# EAGLE design version1 (EAGLE 6.6.0)
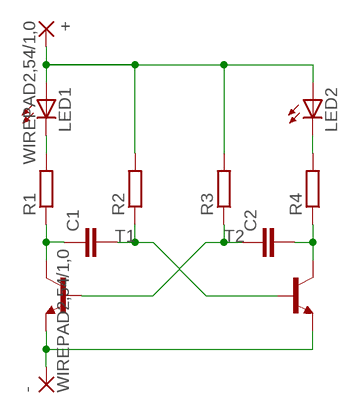
[diagram p0: schematic, sheet 1]

## Parts
+  WIREPAD2,54/1,0  [2,54/1,0]
-  WIREPAD2,54/1,0  [2,54/1,0]
C1  C-EUC0603  [C0603]
C2  C-EUC0603  [C0603]
LED1  LEDSML0603  [SML0603]
LED2  LEDSML0603  [SML0603]
R1  R-EU_R0603  [R0603]
R2  R-EU_R0603  [R0603]
R3  R-EU_R0603  [R0603]
R4  R-EU_R0603  [R0603]
T1  MMBT2222ALT1-NPN-SOT23-BEC  [SOT23-BEC]
T2  MMBT2222ALT1-NPN-SOT23-BEC  [SOT23-BEC]

## Nets
N$1: LED1.C R1.2
N$2: C1.1 R1.1 T1.C
N$3: C2.2 R4.1 T2.C
N$4: LED2.C R4.2
N$5: C1.2 R2.1 T2.B
N$6: C2.1 R3.1 T1.B
N$7: +.1(P) LED1.A LED2.A R2.2 R3.2
N$9: -.1(P) T1.E T2.E

## Library data of the parts
+ - = wirepad:WIREPAD: Wire PAD connect wire on PCB
C1 C2 = rcl:C-EU: CAPACITOR, European symbol
LED1 LED2 = led:LED: LED OSRAM: - CHIPLED LG R971, LG N971, LY N971, LG Q971, LY Q971, LO R971, LY R971 LH N974, LH R974 LS Q976, LO Q976, LY Q976 LO Q996 - Hyper CHIPLED LW Q18S LB Q993, LB Q99A, LB R99A - SideLED LS A670, LO A670, LY A670, LG A670, LP A670 LB A673, LV A673, LT A673, LW A673 LH A674 LY A675 LS A676, LA A676, LO A676, LY A676, LW A676 LS A679, LY A679, LG A679 - Hyper Micro SIDELED® LS Y876, LA Y876, LO Y876, LY Y876 LT Y87S - SmartLED LW L88C, LW L88S LB L89C, LB L89S, LG L890 LS L89K, LO L89K, LY L89K LS L896, LA L896, LO L896, LY L896 - TOPLED LS T670, LO T670, LY T670, LG T670, LP T670 LSG T670, LSP T670, LSY T670, LOP T670, LYG T670 LG T671, LOG T671, LSG T671 LB T673, LV T673, LT T673, LW T673 LH T674 LS T676, LA T676, LO T676, LY T676, LB T676, LH T676, LSB T676, LW T676 LB T67C, LV T67C, LT T67C, LS T67K, LO T67K, LY T67K, LW E67C LS E67B, LA E67B, LO E67B, LY E67B, LB E67C, LV E67C, LT E67C LW T67C LS T679, LY T679, LG T679 LS T770, LO T770, LY T770, LG T770, LP T770 LB T773, LV T773, LT T773, LW T773 LH T774 LS E675, LA E675, LY E675, LS T675 LS T776, LA T776, LO T776, LY T776, LB T776 LHGB T686 LT T68C, LB T68C - Hyper Mini TOPLED® LB M676 - Mini TOPLED Santana® LG M470 LS M47K, LO M47K, LY M47K Source: http://www.osram.convergy.de LUXEON: - LUMILED® LXK2-PW12-R00, LXK2-PW12-S00, LXK2-PW14-U00, LXK2-PW14-V00 LXK2-PM12-R00, LXK2-PM12-S00, LXK2-PM14-U00 LXK2-PE12-Q00, LXK2-PE12-R00, LXK2-PE12-S00, LXK2-PE14-T00, LXK2-PE14-U00 LXK2-PB12-K00, LXK2-PB12-L00, LXK2-PB12-M00, LXK2-PB14-N00, LXK2-PB14-P00, LXK2-PB14-Q00 LXK2-PR12-L00, LXK2-PR12-M00, LXK2-PR14-Q00, LXK2-PR14-R00 LXK2-PD12-Q00, LXK2-PD12-R00, LXK2-PD12-S00 LXK2-PH12-R00, LXK2-PH12-S00 LXK2-PL12-P00, LXK2-PL12-Q00, LXK2-PL12-R00 Source: www.luxeon.com KINGBRIGHT: KA-3528ASYC Source: www.kingbright.com
R1-R4 = rcl:R-EU_: RESISTOR, European symbol
T1 T2 = transistor-neu-to92:*-NPN-: NPN Transistror

## Board
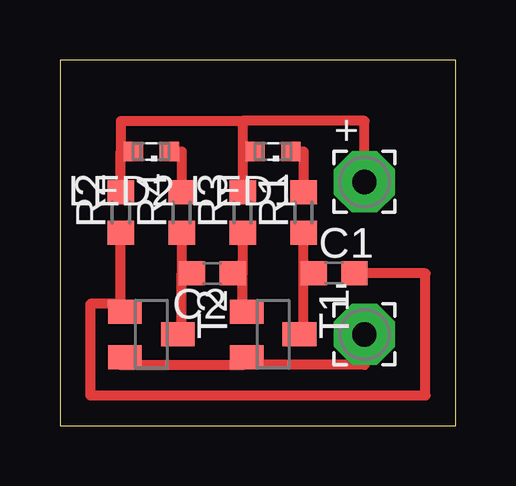
[diagram p1: board, top side]

Size 16.51 x 15.24 mm. Coordinates in mm from the lower left corner, seen from the top.
Outline: 0,0 16.51,0 16.51,15.24 0,15.24 0,0
Copper layers (1*16): Top 0.035mm / dielectric 1.5mm / Bottom 0.035mm
Design rules "default": minimum track width 10mil, minimum drill 24mil, track to track 8mil, track to pad 8mil, pad to pad 8mil, via to via 8mil, smd to smd 8mil, copper to edge 40mil, drill to drill 8mil, minimum pad ring 10mil, minimum via ring 8mil, stop-mask expansion 4mil, vias tented up to drill 0mil, thermal gap 10mil

### Footprints (pad centres in the part's own frame; a part is rotated, then mirrored left to right if it is on the bottom)
2,54/1,0 = drill 1.016 pad 2.54 octagon: 1 0,0
C0603 = smd 1.1 x 1: 1 -0.85,0; 2 0.85,0
SML0603 = smd 0.8 x 0.8: A 0.75,0; C -0.75,0
R0603 = smd 1 x 1.1: 1 -0.85,0; 2 0.85,0
SOT23-BEC = smd 1 x 1.4: B -0.95,-1.1; C 0,1.1; E 0.95,-1.1

### Placement (x,y rotation side)
+  12.7,10.16 0 top
-  12.7,3.81 0 top
C1  11.43,6.35 0 top
C2  6.35,6.35 180 top
LED1  8.89,11.43 180 top
LED2  3.81,11.43 180 top
R1  10.16,8.89 90 top
R2  2.54,8.89 90 top
R3  7.62,8.89 90 top
R4  5.08,8.89 90 top
T1  8.89,3.81 270 top
T2  3.81,3.81 270 top

### Tracks (layer width: path | path; a pad name or v marks a point on that pad's centre or on a via)
N$1
  Top 0.406: LED1.C 10.16,11.43 R1.2
N$2
  Top 0.406: 10.16,6.35 R1.1 | C1.1 10.16,6.35 | T1.C 10.16,3.81 10.16,6.35
N$3
  Top 0.406: R4.1 5.08,6.35 | T2.C 5.08,3.81 5.08,6.35 | 5.08,6.35 C2.2
N$4
  Top 0.406: LED2.C 5.08,11.43 R4.2
N$5
  Top 0.406: 2.54,5.08 R2.1 | T2.B 2.54,4.76 2.54,5.08 | 2.54,5.08 1.27,5.08 1.27,1.27 15.24,1.27 15.24,6.35 C1.2
N$6
  Top 0.406: R3.1 7.62,6.35 | T1.B 7.62,4.76 7.62,6.35 | 7.62,6.35 C2.1
N$7
  Top 0.406: R2.2 2.54,11.43 | LED2.A 2.54,11.43 | 7.62,12.7 2.54,12.7 2.54,11.43 | 7.62,12.7 7.62,11.43 | 7.62,11.43 R3.2 | LED1.A 7.62,11.43 | +.1 12.7,12.7 7.62,12.7
N$9
  Top 0.406: -.1 12.7,2.54 7.62,2.54 | T2.E 2.54,2.86 2.54,2.54 7.62,2.54 | T1.E 7.62,2.86 7.62,2.54